# Altium schematic sheet HANC_Analog_TS.SchDoc
size B
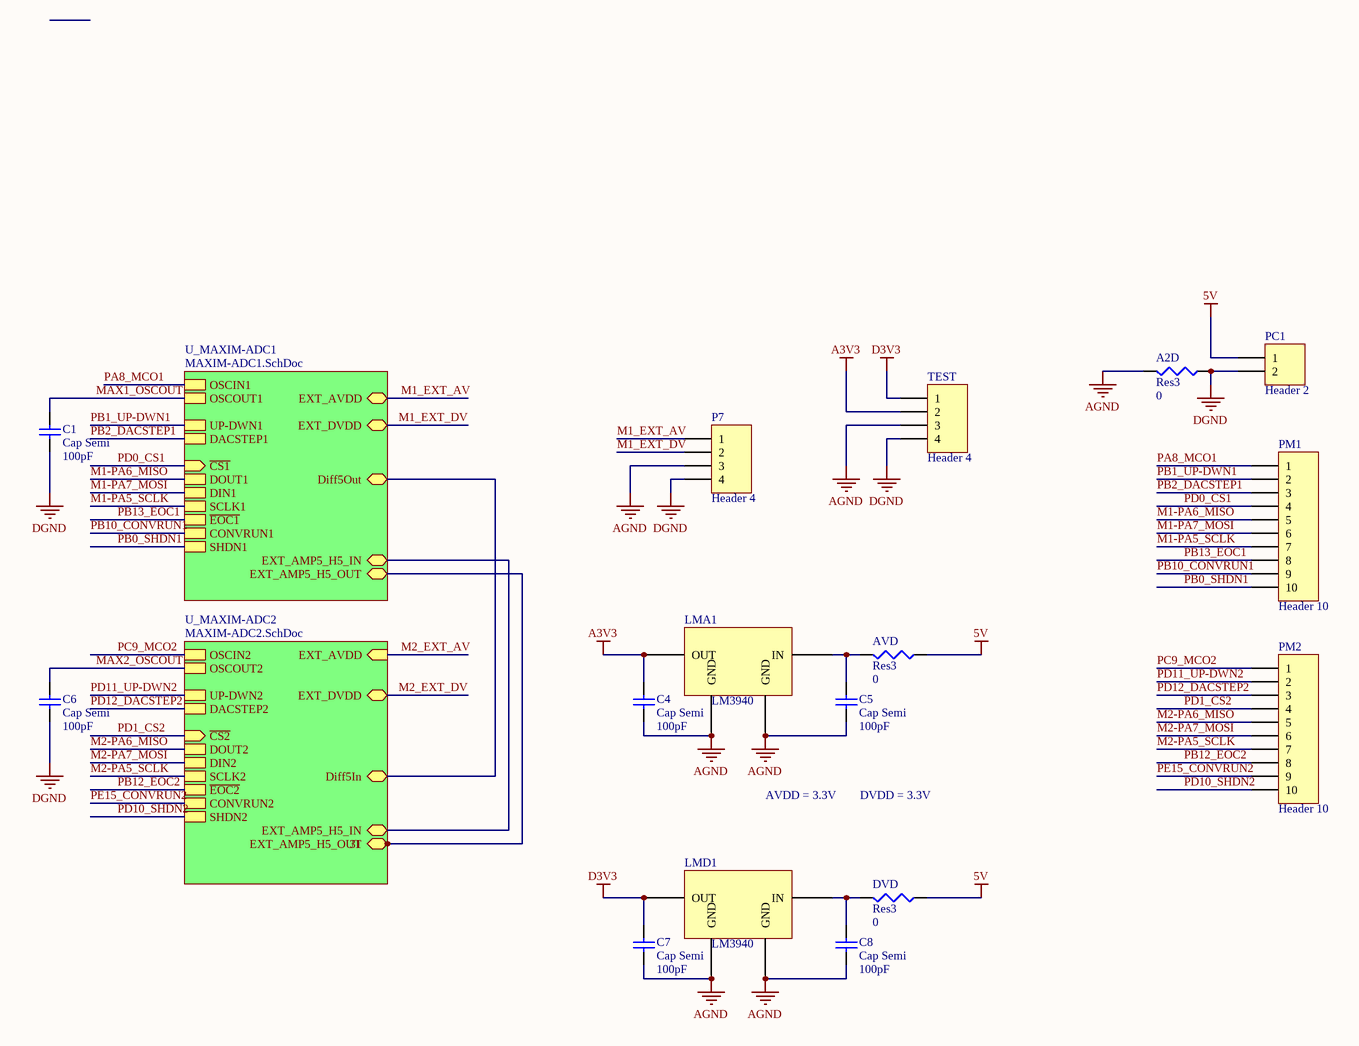
[diagram p0: HANC_Analog_TS.SchDoc]

## Parts
A2D  Res3  value 0  [J1-0603]
AVD  Res3  value 0  [J1-0603]
C1  Cap Semi  value 100pF  [1608[0603]]
C4  Cap Semi  value 100pF  [1608[0603]]
C5  Cap Semi  value 100pF  [1608[0603]]
C6  Cap Semi  value 100pF  [1608[0603]]
C7  Cap Semi  value 100pF  [1608[0603]]
C8  Cap Semi  value 100pF  [1608[0603]]
DVD  Res3  value 0  [J1-0603]
LMA1  LM3940  [SOT223_N]
LMD1  LM3940  [SOT223_N]
P7  Header 4  [HDR1X4]
PC1  Header 2  [HDR1X2]
PM1  Header 10  [HDR1X10]
PM2  Header 10  [HDR1X10]
TEST  Header 4  [HDR1X4]

## Sub-sheets
U_MAXIM-ADC1 = MAXIM-ADC1.SchDoc: OSCIN1, OSCOUT1, UP-DWN1, DACSTEP1, ~{CS1} (in), DOUT1, DIN1, SCLK1, ~{EOC1}, CONVRUN1, SHDN1, EXT_AVDD, EXT_DVDD, Diff5Out, EXT_AMP5_H5_IN, EXT_AMP5_H5_OUT
U_MAXIM-ADC2 = MAXIM-ADC2.SchDoc: OSCIN2, OSCOUT2, UP-DWN2, DACSTEP2, ~{CS2} (in), DOUT2, DIN2, SCLK2, ~{EOC2}, CONVRUN2, SHDN2, EXT_AVDD (in), EXT_DVDD, Diff5In, 31, EXT_AMP5_H5_OUT, EXT_AMP5_H5_IN

## Nets
5V: AVD.1 DVD.1 PC1.1
A3V3: C4.2 LMA1.3(OUT) TEST.2
AGND: A2D.2 C4.1 C5.1 C7.1 C8.1 LMA1.2(GND) LMA1.4(GND) LMD1.2(GND) LMD1.4(GND) P7.3 TEST.3
D3V3: C7.2 LMD1.3(OUT) TEST.1
DGND: A2D.1 C1.1 C6.1 P7.4 PC1.2 TEST.4
M1-PA5_SCLK: PM1.7 ; sheet U_MAXIM-ADC1/SCLK1
M1-PA6_MISO: PM1.5 ; sheet U_MAXIM-ADC1/DOUT1
M1-PA7_MOSI: PM1.6 ; sheet U_MAXIM-ADC1/DIN1
M1_EXT_AV: P7.1 ; sheet U_MAXIM-ADC1/EXT_AVDD
M1_EXT_DV: P7.2 ; sheet U_MAXIM-ADC1/EXT_DVDD
M2-PA5_SCLK: PM2.7 ; sheet U_MAXIM-ADC2/SCLK2
M2-PA6_MISO: PM2.5 ; sheet U_MAXIM-ADC2/DOUT2
M2-PA7_MOSI: PM2.6 ; sheet U_MAXIM-ADC2/DIN2
M2_EXT_AV: sheet U_MAXIM-ADC2/EXT_AVDD
M2_EXT_DV: sheet U_MAXIM-ADC2/EXT_DVDD
MAX1_OSCOUT: C1.2 ; sheet U_MAXIM-ADC1/OSCOUT1
MAX2_OSCOUT: C6.2 ; sheet U_MAXIM-ADC2/OSCOUT2
PA8_MCO1: PM1.1 ; sheet U_MAXIM-ADC1/OSCIN1
PB0_SHDN1: PM1.10 ; sheet U_MAXIM-ADC1/SHDN1
PB1_UP-DWN1: PM1.2 ; sheet U_MAXIM-ADC1/UP-DWN1
PB2_DACSTEP1: PM1.3 ; sheet U_MAXIM-ADC1/DACSTEP1
PB10_CONVRUN1: PM1.9 ; sheet U_MAXIM-ADC1/CONVRUN1
PB12_EOC2: PM2.8 ; sheet U_MAXIM-ADC2/~{EOC2}
PB13_EOC1: PM1.8 ; sheet U_MAXIM-ADC1/~{EOC1}
PC9_MCO2: PM2.1 ; sheet U_MAXIM-ADC2/OSCIN2
PD0_CS1: PM1.4 ; sheet U_MAXIM-ADC1/~{CS1}
PD1_CS2: PM2.4 ; sheet U_MAXIM-ADC2/~{CS2}
PD10_SHDN2: PM2.10 ; sheet U_MAXIM-ADC2/SHDN2
PD11_UP-DWN2: PM2.2 ; sheet U_MAXIM-ADC2/UP-DWN2
PD12_DACSTEP2: PM2.3 ; sheet U_MAXIM-ADC2/DACSTEP2
PE15_CONVRUN2: PM2.9 ; sheet U_MAXIM-ADC2/CONVRUN2
NetAVD_2: AVD.2 C5.2 LMA1.1(IN)
NetC8_2: C8.2 DVD.2 LMD1.1(IN)
(unnamed): sheet U_MAXIM-ADC2/Diff5In, sheet U_MAXIM-ADC1/Diff5Out
(unnamed): sheet U_MAXIM-ADC2/31, sheet U_MAXIM-ADC2/EXT_AMP5_H5_OUT, sheet U_MAXIM-ADC1/EXT_AMP5_H5_OUT
(unnamed): sheet U_MAXIM-ADC2/EXT_AMP5_H5_IN, sheet U_MAXIM-ADC1/EXT_AMP5_H5_IN

## Notes on the sheet
- AVDD = 3.3V
- DVDD = 3.3V

## Library data of the parts
A2D AVD DVD = Res3: Resistor; Published: 8-Jun-2000; LatestRevisionDate: 29-May-2009; LatestRevisionNote: IPC-7351 Footprint Added.; PackageReference: J1-0603; Publisher: Altium Limited; PackageDescription: Chip Resistor
C1 C4-C8 = Cap Semi: Capacitor (Semiconductor SIM Model); Published: 8-Jun-2000; LatestRevisionDate: 29-May-2009; LatestRevisionNote: IPC-7351 Footprint Added.; PackageReference: C1206; Publisher: Altium Limited; PackageDescription: Chip Capacitor
LMA1 LMD1 = Component_1
P7 = Header 4: External power for ADC1; LatestRevisionDate: 17-Jul-2002; LatestRevisionNote: Re-released for DXP Platform.; Publisher: Altium Limited
PC1 = Header 2: Power for analog board; LatestRevisionDate: 17-Jul-2002; LatestRevisionNote: Re-released for DXP Platform.; Publisher: Altium Limited
PM1 = Header 10: GPIO for ADC1; LatestRevisionDate: 17-Jul-2002; LatestRevisionNote: Re-released for DXP Platform.; Publisher: Altium Limited
PM2 = Header 10: GPIO for ADC2; LatestRevisionDate: 17-Jul-2002; LatestRevisionNote: Re-released for DXP Platform.; Publisher: Altium Limited
TEST = Header 4: Header, 4-Pin; LatestRevisionDate: 17-Jul-2002; LatestRevisionNote: Re-released for DXP Platform.; Publisher: Altium Limited